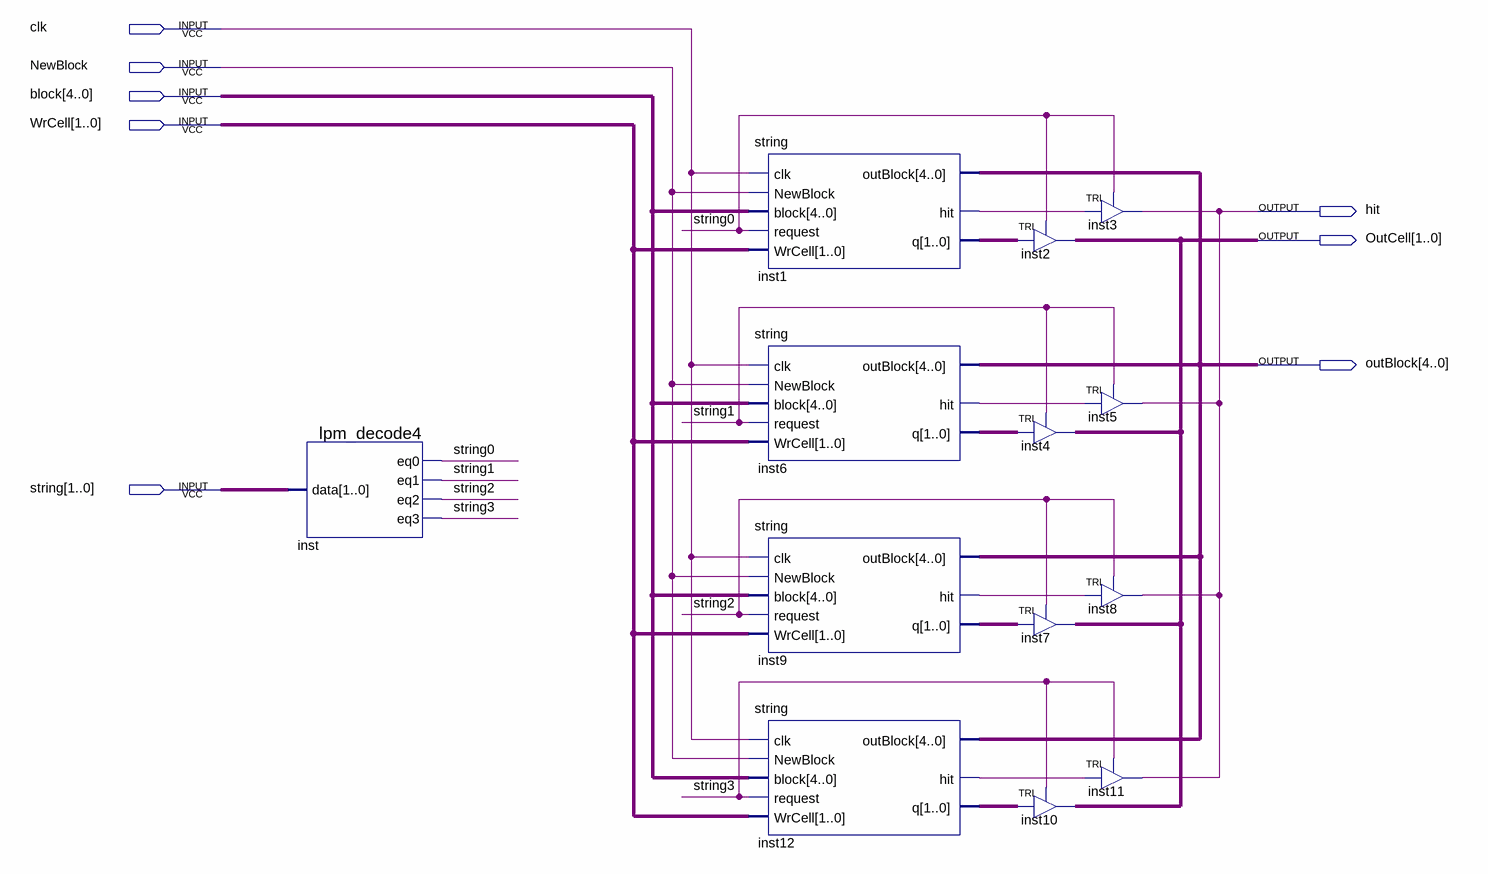
[diagram p0: schematic sheet]
// Quartus schematic TagMemory.bdf as structural Verilog: 13 symbols, 8 pins
module TagMemory (
  input  clk,
  input  NewBlock,
  input  [4:0] block,
  input  [1:0] WrCell,
  input  [1:0] \string ,
  output hit,
  output [1:0] OutCell,
  output [4:0] outBlock
);

  wire inst1_hit, inst6_hit, inst9_hit, inst12_hit, string2, string3;
  wire [1:0] inst1_q, inst6_q, inst9_q, inst12_q;

  lpm_decode4 inst (.data(\string ), .eq0(\string [0]), .eq1(\string [1]), .eq2(string2), .eq3(string3));
  \string  inst1 (
    .clk(clk), .NewBlock(NewBlock), .block(block), .request(\string [0]), .WrCell(WrCell),
    .outBlock(outBlock), .hit(inst1_hit), .q(inst1_q));
  \string  inst6 (
    .clk(clk), .NewBlock(NewBlock), .block(block), .request(\string [1]), .WrCell(WrCell),
    .outBlock(outBlock), .hit(inst6_hit), .q(inst6_q));
  \string  inst9 (
    .clk(clk), .NewBlock(NewBlock), .block(block), .request(string2), .WrCell(WrCell), .outBlock(outBlock),
    .hit(inst9_hit), .q(inst9_q));
  \string  inst12 (
    .clk(clk), .NewBlock(NewBlock), .block(block), .request(string3), .WrCell(WrCell), .outBlock(outBlock),
    .hit(inst12_hit), .q(inst12_q));
  TRI inst2[1:0] (.IN(inst1_q), .OE(\string [0]), .OUT(OutCell));
  TRI inst4[1:0] (.IN(inst6_q), .OE(\string [1]), .OUT(OutCell));
  TRI inst7[1:0] (.IN(inst9_q), .OE(string2), .OUT(OutCell));
  TRI inst10[1:0] (.IN(inst12_q), .OE(string3), .OUT(OutCell));
  TRI inst3 (.IN(inst1_hit), .OE(\string [0]), .OUT(hit));
  TRI inst5 (.IN(inst6_hit), .OE(\string [1]), .OUT(hit));
  TRI inst8 (.IN(inst9_hit), .OE(string2), .OUT(hit));
  TRI inst11 (.IN(inst12_hit), .OE(string3), .OUT(hit));
endmodule
